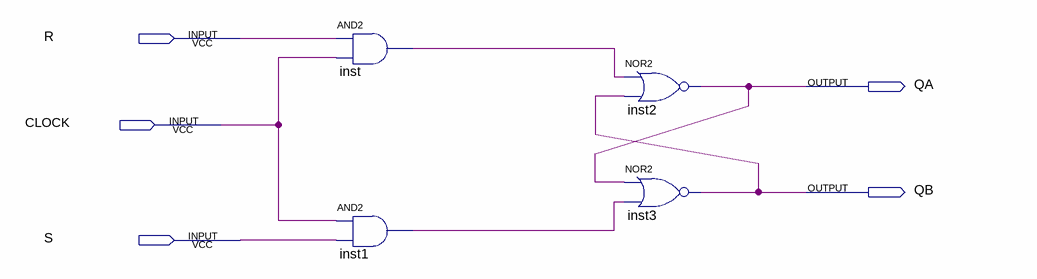
[diagram p0: schematic sheet]
// Quartus schematic PARTE1TESTE.bdf as structural Verilog: 4 symbols, 5 pins
module PARTE1TESTE (
  input  R,
  input  CLOCK,
  input  S,
  output QA,
  output QB
);

  wire inst1_out, inst_out;

  and inst (inst_out, R, CLOCK);
  and inst1 (inst1_out, CLOCK, S);
  nor inst2 (QA, inst_out, QB);
  nor inst3 (QB, QA, inst1_out);
endmodule
